# EAGLE schematic ATtiny4313_PN532 (EAGLE 6.5.0)
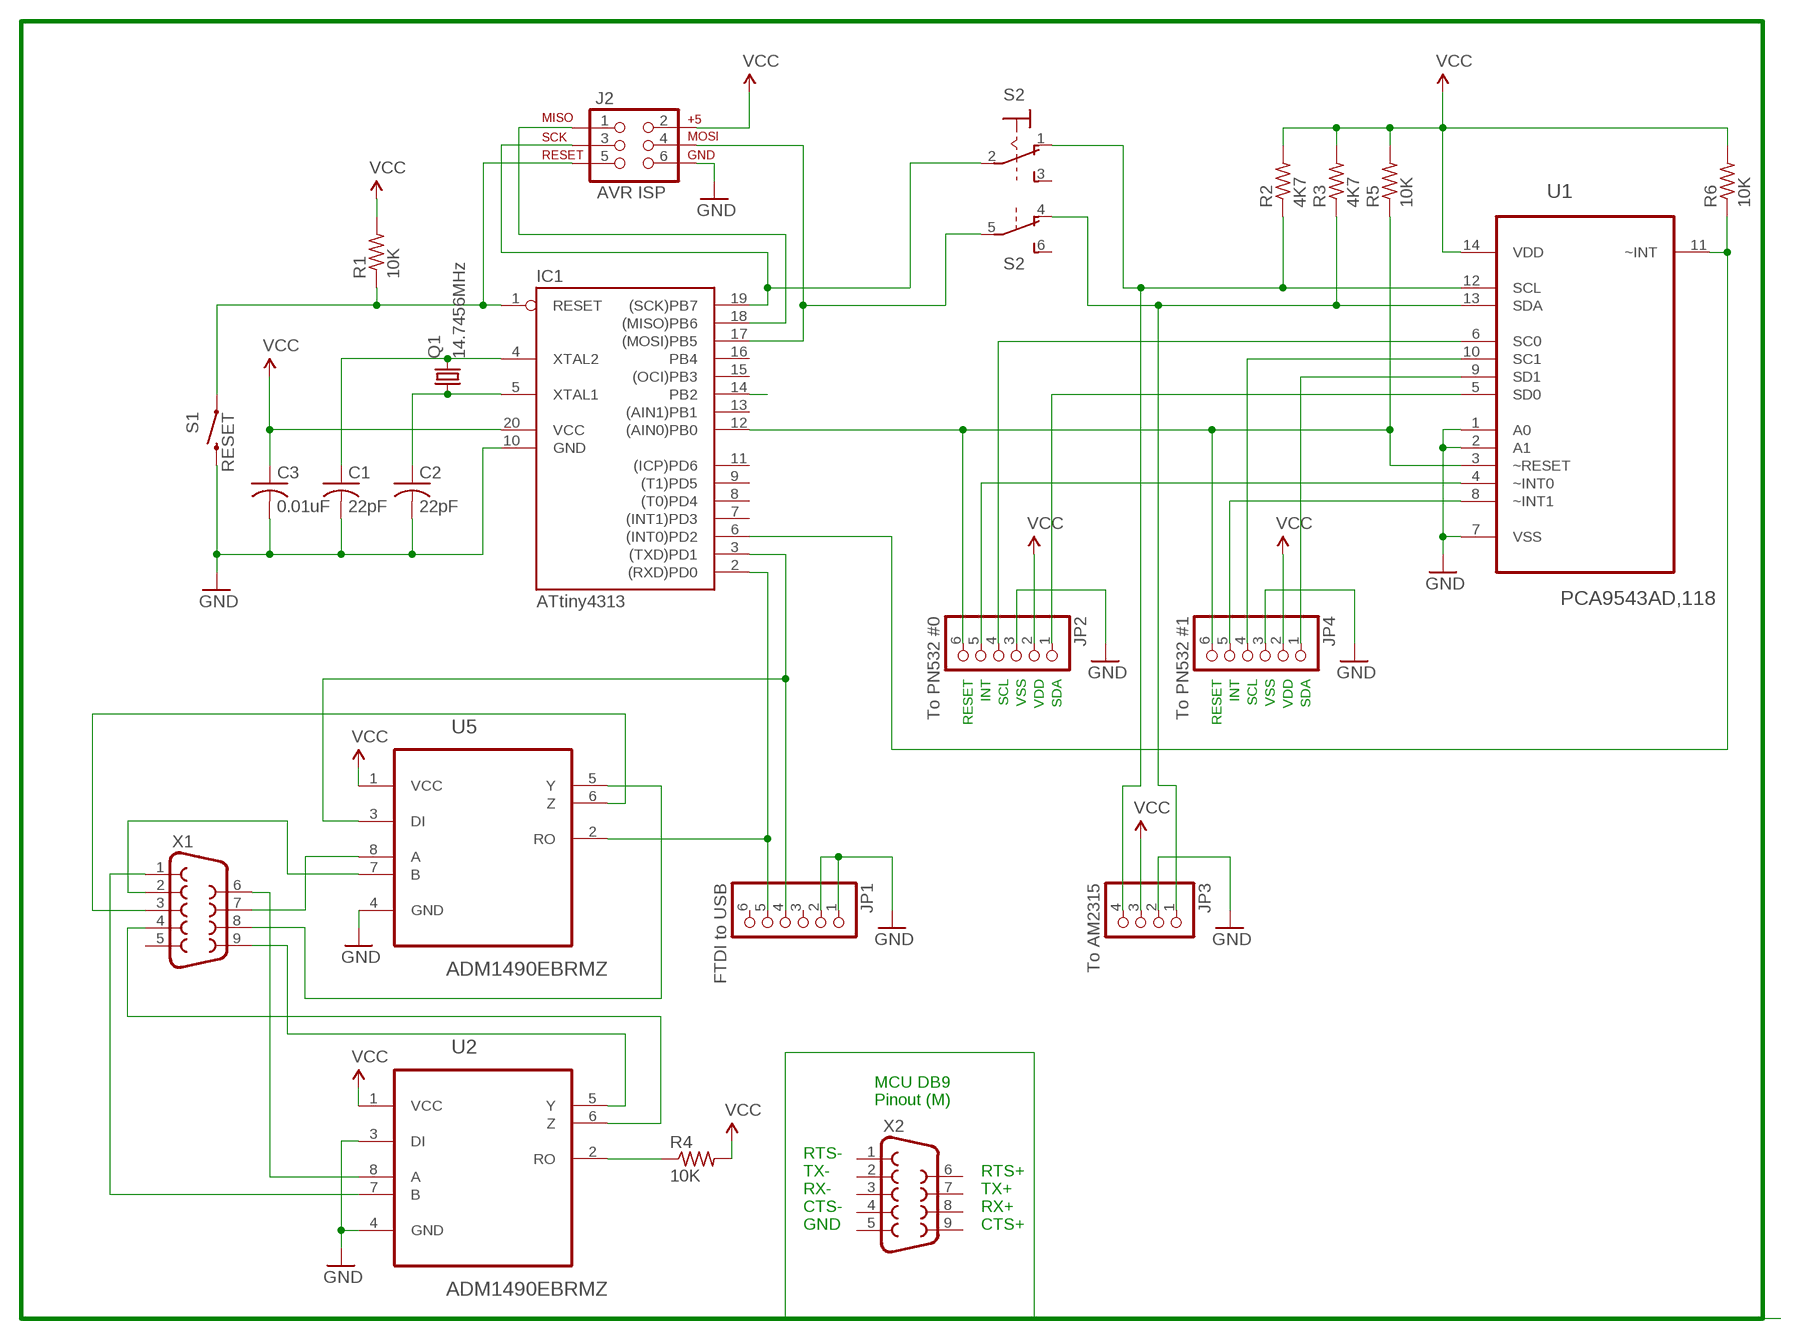
[diagram p0: schematic, sheet 1]

## Parts
C1  22pF  C-US025-024X044  [C025-024X044]
C2  22pF  C-US025-024X044  [C025-024X044]
C3  0.01uF  C-US025-024X044  [C025-024X044]
IC1  ATtiny4313  AT90S2313P  [DIL20]
J2  AVR ISP  AVR_SPI_PRG_6PTH  [2X3]
JP1  FTDI to USB  PINHD-1X6/90  [1X06/90]
JP2  To PN532 #0  PINHD-1X6/90  [1X06/90]
JP3  To AM2315  PINHD-1X4/90  [1X04/90]
JP4  To PN532 #1  PINHD-1X6/90  [1X06/90]
Q1  14.7456MHz  CRYSTALHC49U-V  [HC49U-V]
R1  10K  R-US_0204/2V  [0204V]
R2  4K7  R-US_0204/2V  [0204V]
R3  4K7  R-US_0204/2V  [0204V]
R4  10K  R-US_0204/2V  [0204V]
R5  10K  R-US_0204/2V  [0204V]
R6  10K  R-US_0204/2V  [0204V]
S1  RESET  SWITCH-MOMENTARY-2PTH  [TACTILE-PTH]
S2  320-938  [320-938]
U1  PCA9543AD,118  [SOIC127P600X175-14N]
U2  ADM1490EBRMZ  [SOP65P490X110-8N]
U5  ADM1490EBRMZ  [SOP65P490X110-8N]
X1  DB9MALE  [DB9_MALE]
X2  DB9MALE  [DB9_MALE]

## Nets
GND: C1.2 C2.2 C3.2 IC1.10(GND) J2.6 JP1.1 JP1.2 JP2.3 JP3.2 JP4.3 S1.3 U1.1(A0) U1.2(A1) U1.7(VSS) U2.3(DI) U2.4(GND) U5.4(GND)
N$1: IC1.1(RESET) J2.5 R1.1 S1.1
N$2: C2.1 IC1.5(XTAL1) Q1.1
N$3: IC1.3((TXD)PD1) JP1.4 U5.3(DI)
N$4: IC1.2((RXD)PD0) JP1.5 U5.2(RO)
N$5: U5.6(Z) X1.3
N$6: C1.1 IC1.4(XTAL2) Q1.2
N$7: R4.1 U2.2(RO)
N$8: IC1.6((INT0)PD2) R6.1 U1.11(~INT)
N$9: IC1.14(PB2)
N$10: JP2.1 U1.5(SD0)
N$11: JP2.4 U1.6(SC0)
N$12: JP4.1 U1.9(SD1)
N$13: JP4.4 U1.10(SC1)
N$14: IC1.12((AIN0)PB0) JP2.6 JP4.6 R5.1 U1.3(~RESET)
N$15: IC1.18((MISO)PB6) J2.1
N$16: JP2.5 U1.4(~INT0)
N$17: U5.8(A) X1.7
N$18: JP4.5 U1.8(~INT1)
N$19: U5.7(B) X1.2
N$20: U2.5(Y) X1.9
N$21: U5.5(Y) X1.8
N$22: U2.6(Z) X1.4
N$23: U2.8(A) X1.6
N$24: U2.7(B) X1.1
N$28: JP3.4 R2.1 S2.1(1:O) U1.12(SCL)
N$29: JP3.1 R3.1 S2.4(B:O) U1.13(SDA)
SCL: IC1.19((SCK)PB7) J2.3 S2.2(1:P)
SDA: IC1.17((MOSI)PB5) J2.4 S2.5(B:P)
VCC: C3.1 IC1.20(VCC) J2.2 JP2.2 JP3.3 JP4.2 R1.2 R2.2 R3.2 R4.2 R5.2 R6.2 U1.14(VDD) U2.1(VCC) U5.1(VCC)
Unconnected: IC1.7((INT1)PD3) IC1.8((T0)PD4) IC1.9((T1)PD5) IC1.11((ICP)PD6) IC1.13((AIN1)PB1) IC1.15((OCI)PB3) IC1.16(PB4) JP1.3 JP1.6 S2.3(1:S) S2.6(B:S) X1.5 X2.1 X2.2 X2.3 X2.4 X2.5 X2.6 X2.7 X2.8 X2.9

## Notes on the sheet
- RESET | INT | SCL | VSS | VDD | SDA | RESET | INT | SCL | VSS | VDD | SDA
- MCU DB9
  Pinout (M)
- RTS-
- TX- | RTS+
- RX- | TX+
- CTS- | RX+
- GND | CTS+

## Library data of the parts
C1-C3 = rcl:C-US: CAPACITOR, American symbol
IC1 = avr-5:AT90S2313: MICROCONTROLLER 2 Kbytes FLASH 128 bytes SRAM 128 bytes EEPROM UART
J2 = SparkFun-Connectors:AVR_SPI_PRG_6: AVR ISP 6 Pin This is the reduced ISP connector for AVR programming. Common on Arduino. This footprint will take up less PCB space and can be used with a 10-pin to 6-pin adapter such as SKU: BOB-08508
JP1 JP2 JP4 = pinhead:PINHD-1X6: PIN HEADER
JP3 = pinhead:PINHD-1X4: PIN HEADER
Q1 = crystal:CRYSTAL: CRYSTAL; OC_FARNELL: 1666969; OC_NEWARK: unknown
R1-R6 = rcl:R-US_: RESISTOR, American symbol
S1 = SparkFun-Electromechanical:SWITCH-MOMENTARY-2: Various NO switches- pushbuttons, reed, etc
S2 = switch:320-938: TOGGLE SWITCH distributor RS Components
U1 = NXP_By_element14_Batch_1:PCA9543AD,118: 2-channel I2C-bus switch with interrupt logic and reset; MPN: PCA9543AD,118; OC_FARNELL: -; OC_NEWARK: 70R6590; PACKAGE: SOP-14; SUPPLIER: NXP
U2 U5 = Analog Devices_By_element14_Batch_1:ADM1490EBRMZ: Transceivers; MPN: ADM1490EBRMZ; OC_FARNELL: -; OC_NEWARK: 67R2188; PACKAGE: MSOP-8; SUPPLIER: Analog Devices
X1 X2 = SparkFun-Connectors:DB9: DB9 Connector Standard DB9 (D-Sub 9) serial connector. Can be used for CAN bus as well as RS485 and RS232. Footprint production proven. Spark Fun Electronics SKU : PRT-00429